# EAGLE design dm4_midi_brk_v1 (EAGLE 7.7.0)
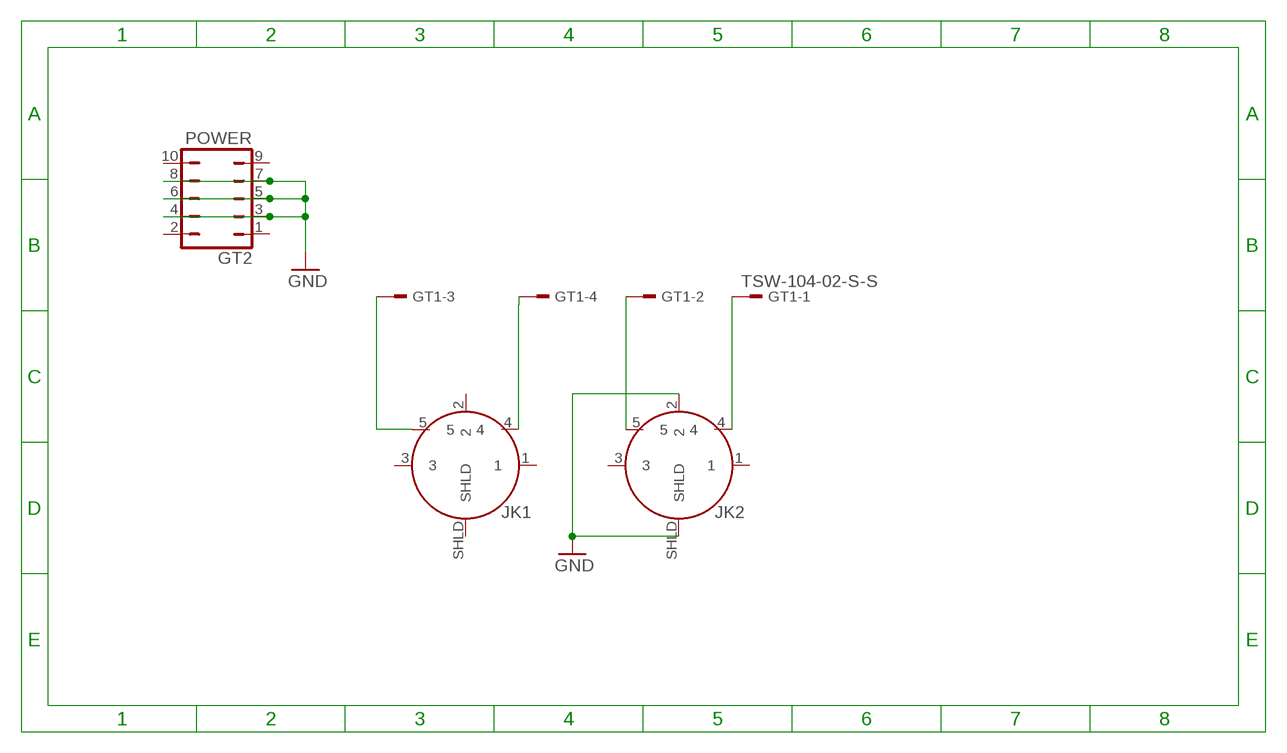
[diagram p0: schematic, sheet 1]

## Parts
GT1  TSW-104-02-S-S  [TSW-104-02-S-S]
GT2  POWER  JP5Q  [JP5Q]
JK1  13HP021PCB  [13HP021PCB]
JK2  13HP021PCB  [13HP021PCB]

## Nets
GND [power]: GT2.3 GT2.4 GT2.5 GT2.6 GT2.7 GT2.8 JK2.2 JK2.SHLD
N$4: GT1.3 JK1.5
N$12: GT1.1 JK2.4
N$29: GT1.2 JK2.5
N$34: GT1.4 JK1.4
Unconnected: GT2.1 GT2.2 GT2.9 GT2.10 JK1.1 JK1.2 JK1.3 JK1.SHLD JK2.1 JK2.3

## Library data of the parts
GT1 = con-samtec:TSW-104-02-S-S: THROUGH-HOLE .025" SQ POST HEADER Source: Samtec TSW.pdf; OC_FARNELL: unknown; OC_NEWARK: unknown
GT2 = digital-audio:JP5Q: JUMPER
JK1 JK2 = digital-audio:13HP021PCB: 13HP021PCB 5 pin DIN 180 degree PCB mounting with panels holes

## Net classes
0 default: width 0.406 mm, drill 0.5 mm
1 pcm1680: width 0.35 mm
2 power: width 0.61 mm, clearance 0.254 mm
3 output: width 0.61 mm, clearance 0.254 mm

## Board
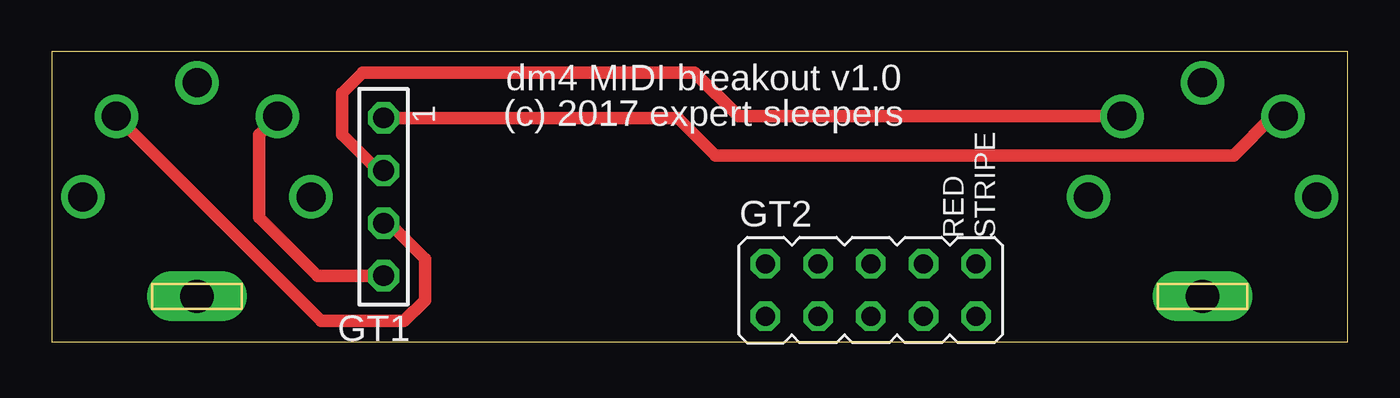
[diagram p1: board, top side]
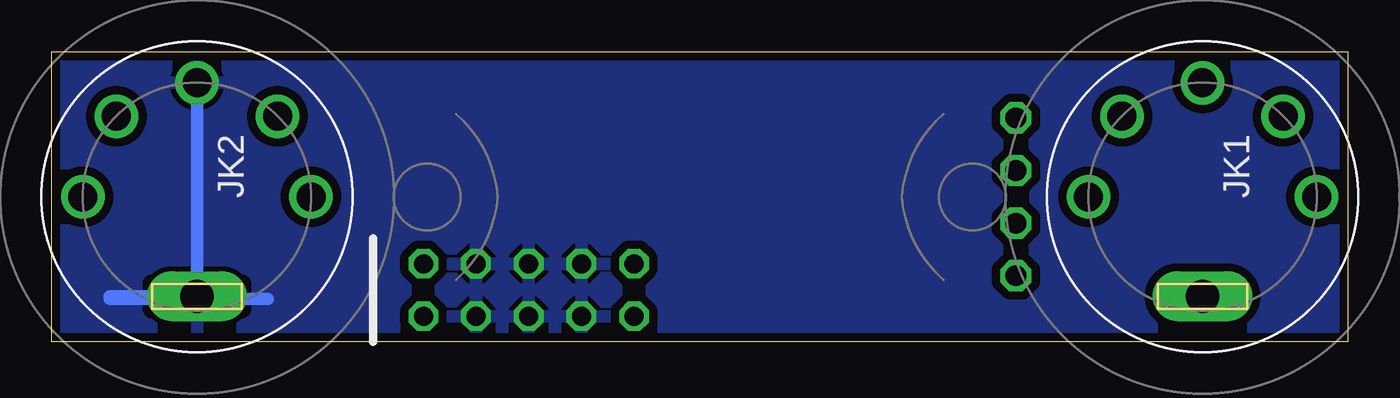
[diagram p2: board, bottom side, seen from below]

Size 62.5 x 14 mm. Coordinates in mm from the lower left corner, seen from the top.
Outline: 0,0 62.5,0 62.5,14 0,14 0,0
Copper layers (1*16): Top 0.035mm / dielectric 1.5mm / Bottom 0.035mm
Design rules "pcbtrain": minimum track width 0.125mm, minimum drill 0.2mm, track to track 0.125mm, track to pad 0.125mm, pad to pad 0.125mm, via to via 0.125mm, smd to smd 0.125mm, copper to edge 0.25mm, drill to drill 8mil, minimum pad ring 10mil, minimum via ring 8mil, stop-mask expansion 4mil, vias tented up to drill 0mil, thermal gap 10mil

### Footprints (pad centres in the part's own frame; a part is rotated, then mirrored left to right if it is on the bottom)
TSW-104-02-S-S = drill 1 pad 1.5 octagon: 1 3.81,0; 2 1.27,0; 3 -1.27,0; 4 -3.81,0
JP5Q = drill 0.914 octagon: 1 -5.08,-1.27; 2 -5.08,1.27; 3 -2.54,-1.27; 4 -2.54,1.27; 5 0,-1.27; 6 0,1.27; 7 2.54,-1.27; 8 2.54,1.27; 9 5.08,-1.27; 10 5.08,1.27
13HP021PCB = drill 1.4: 1 0,-5.5; 2 -5.5,0; 3 0,5.5; 4 -3.889,-3.889; 5 -3.889,3.889 | drill 1.6 long: SHLD 4.8,0

### Placement (x,y rotation side)
GT1  16,7 90 top
GT2  39.5,2.5 0 top
JK1  7,7 270 bottom
JK2  55.5,7 270 bottom

### Tracks (layer width: path | path; a pad name or v marks a point on that pad's centre or on a via)
GND
  Bottom 0.61: JK2.SHLD 59.71,2.2 59.71,2.08 55.5,2.08 | 52.09,2.08 55.5,2.08 | 55.5,2.08 JK2.2
  pour Bottom (isolate 0.406): 0,0 62.5,0 62.5,14 0,14
N$4
  Top 0.61: GT1.3 16.27,5.73 18,4 18,2 17,1 13,1 JK1.5
N$12
  Top 0.61: JK2.4 58.89,10.89 57,9 32,9 30.19,10.81 GT1.1
N$29
  Top 0.61: GT1.2 15.73,8.27 14,10 14,12 15,13 31,13 33.11,10.89 JK2.5
N$34
  Top 0.61: GT1.4 12.81,3.19 10,6 10,10 JK1.4

### Text on the board
tPlace: dm4 MIDI breakout v1.0 | (c) 2017 expert sleepers | RED / STRIPE